# Altium project filtroFinal.PrjPCB
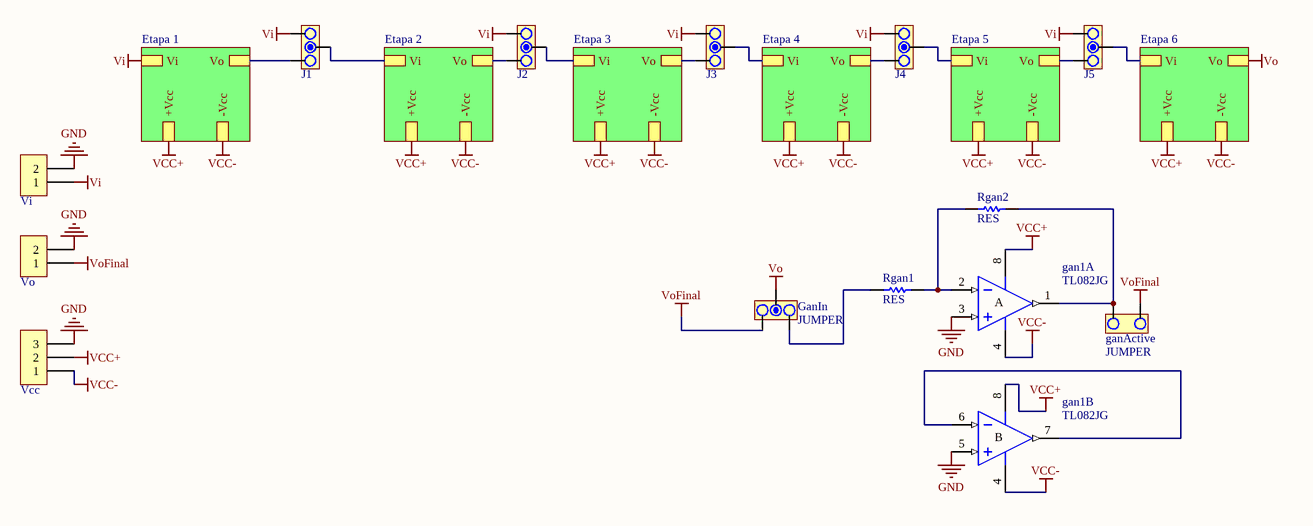
[diagram p0: filtroFinal-TC.SchDoc]
7 sheets, 131 parts. Net scope: hierarchical (ports join the sheet entries above them; power ports are global).
Sheets:
  filtroFinal-TC.SchDoc
    Etapa 1 = etapa1.SchDoc
    Etapa 2 = etapa2.SchDoc
    Etapa 3 = etapa3.SchDoc
    Etapa 4 = etapa4.SchDoc
    Etapa 5 = etapa5.SchDoc
    Etapa 6 = etapa6.SchDoc

## Sheet filtroFinal-TC.SchDoc
size Letter

### Parts
gan1  TL082JG  [JG008]  (parts A,B of 2)
ganActive  JUMPER  [JUMPER2]
GanIn  JUMPER  [JUMPER3]
J1  JUMPER  [JUMPER3]  (value not drawn)
J2  JUMPER  [JUMPER3]  (value not drawn)
J3  JUMPER  [JUMPER3]  (value not drawn)
J4  JUMPER  [JUMPER3]  (value not drawn)
J5  JUMPER  [JUMPER3]  (value not drawn)
Rgan1  RES  [RES300]
Rgan2  RES  [RES300]
Vcc  BORNERA 3  [BORNERA3]  (value not drawn)
Vi  BORNERA 2  [BORNERA2]  (value not drawn)
Vo  BORNERA 2  [BORNERA2]  (value not drawn)

### Sub-sheets
Etapa 1 = etapa1.SchDoc: -Vcc, +Vcc, Vi, Vo
Etapa 2 = etapa2.SchDoc: -Vcc, +Vcc, Vi, Vo
Etapa 3 = etapa3.SchDoc: -Vcc, +Vcc, Vi, Vo
Etapa 4 = etapa4.SchDoc: -Vcc, +Vcc, Vi, Vo
Etapa 5 = etapa5.SchDoc: -Vcc, +Vcc, Vi, Vo
Etapa 6 = etapa6.SchDoc: -Vcc, +Vcc, Vi, Vo

### Nets
GND: gan1.3(IN+) gan1.5(IN+) Vcc.3 Vi.2 Vo.2
VCC+: gan1.8(V+) Vcc.2 ; sheet Etapa 1/+Vcc, sheet Etapa 2/+Vcc, sheet Etapa 3/+Vcc, sheet Etapa 4/+Vcc, sheet Etapa 5/+Vcc, sheet Etapa 6/+Vcc  [project net -VCC]
VCC-: gan1.4(V-) Vcc.1 ; sheet Etapa 1/-Vcc, sheet Etapa 2/-Vcc, sheet Etapa 3/-Vcc, sheet Etapa 4/-Vcc, sheet Etapa 5/-Vcc, sheet Etapa 6/-Vcc  [project net +VCC]
Vi: J1.3 J2.3 J3.3 J4.3 J5.3 Vi.1 ; sheet Etapa 1/Vi
Vi(E2): J1.2 ; sheet Etapa 2/Vi
Vi(E3): J2.2 ; sheet Etapa 3/Vi
Vi(E4): J3.2 ; sheet Etapa 4/Vi
Vi(E5): J4.2 ; sheet Etapa 5/Vi
Vi(E6): J5.2 ; sheet Etapa 6/Vi
Vo: GanIn.2 ; sheet Etapa 6/Vo
Vo(E1): J1.1 ; sheet Etapa 1/Vo
Vo(E2): J2.1 ; sheet Etapa 2/Vo
Vo(E3): J3.1 ; sheet Etapa 3/Vo
Vo(E4): J4.1 ; sheet Etapa 4/Vo
Vo(E5): J5.1 ; sheet Etapa 5/Vo
VoFinal: ganActive.2 GanIn.3 Vo.1
Netgan1_1: gan1.1(OUT) ganActive.1 Rgan2.2
Netgan1_2: gan1.2(IN-) Rgan1.2 Rgan2.1
Netgan1_6: gan1.6(IN-) gan1.7(OUT)
NetGanIn_1: GanIn.1 Rgan1.1

### Notes on the sheet
- (in symbol TL082JG, part A) A
- (in symbol TL082JG, part B) B

### Library data of the parts
gan1 = TL082JG: JFET-Input Operational Amplifier; Published: 16-Jan-2001; LatestRevisionDate: 04-Mar-2005; LatestRevisionNote: Stylized 3D Model Added.; DatasheetVersion: Feb-1999; PackageVersion: Jan-1995; PackageReference: JG008; Publisher: Altium Limited; PackageDescription: DIP; 8 Leads; Row Spacing 7.62 mm; Pitch 2.54 mm; ComponentLink1Description: Manufacturer Link; ComponentLink1URL: http://www.ti.com/; ComponentLink2Description: Datasheet; ComponentLink2URL: http://www-s.ti.com/sc/ds/tl082.pdf
GanIn J1-J5 = JUMPER3

## Sheet etapa1.SchDoc
size A
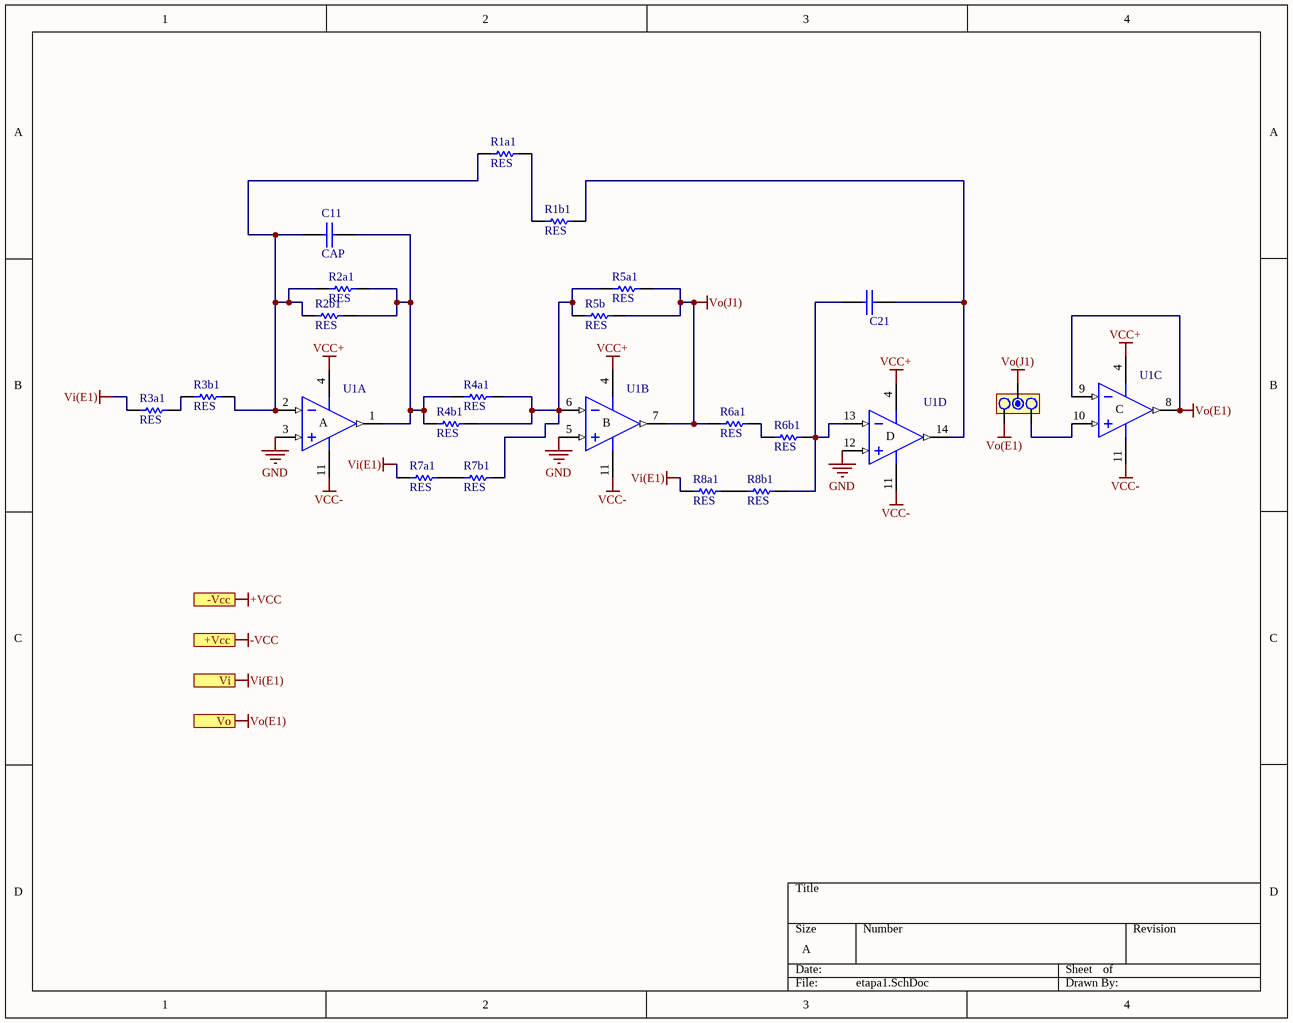
[diagram p1: etapa1.SchDoc]

### Parts
C11  CAP  [CAP200]
C21  CAP  [CAP200]  (value not drawn)
Jumper1  JUMPER  [JUMPER3]  (value not drawn)
R1a1  RES  [0805]
R1b1  RES  [0805]
R2a1  RES  [0805]
R2b1  RES  [0805]
R3a1  RES  [0805]
R3b1  RES  [0805]
R4a1  RES  [0805]
R4b1  RES  [0805]
R5a1  RES  [0805]
R5b  RES  [0805]
R6a1  RES  [0805]
R6b1  RES  [0805]
R7a1  RES  [0805]
R7b1  RES  [0805]
R8a1  RES  [0805]
R8b1  RES  [0805]
U1  TL084N  [N014]  (value not drawn)  (parts A,B,C,D of 4)

### Ports
+Vcc, -Vcc, Vi, Vo

### Nets
+VCC: U1.11(V-) ; port -Vcc  [also labelled VCC-]
-VCC: U1.4(V+) ; port +Vcc  [also labelled VCC+]
GND: U1.3(IN+) U1.5(IN+) U1.12(IN+)
Vi(E1): R3a1.1 R7a1.1 R8a1.1 ; port Vi  [project net Vi]
Vo(E1): Jumper1.3 U1.8(OUT) U1.9(IN-) ; port Vo
Vo(J1): Jumper1.2 R5a1.2 R5b.2 R6a1.1 U1.7(OUT)
NetC11_1: C11.1 R1a1.1 R2a1.1 R2b1.1 R3b1.2 U1.2(IN-)
NetC11_2: C11.2 R2a1.2 R2b1.2 R4a1.1 R4b1.1 U1.1(OUT)
NetC21_1: C21.1 R6b1.2 R8b1.2 U1.13(IN-)
NetC21_2: C21.2 R1b1.2 U1.14(OUT)
NetJumper1_1: Jumper1.1 U1.10(IN+)
NetR1a1_2: R1a1.2 R1b1.1
NetR3a1_2: R3a1.2 R3b1.1
NetR4a1_2: R4a1.2 R4b1.2 R5a1.1 R5b.1 R7b1.2 U1.6(IN-)
NetR6a1_2: R6a1.2 R6b1.1
NetR7a1_2: R7a1.2 R7b1.1
NetR8a1_2: R8a1.2 R8b1.1

### Notes on the sheet
- (in symbol TL084N, part A) A
- (in symbol TL084N, part B) B
- (in symbol TL084N, part C) C
- (in symbol TL084N, part D) D

### Library data of the parts
Jumper1 = JUMPER3
U1 = TL084N: JFET-Input Operational Amplifier; Published: 16-Jan-2001; LatestRevisionDate: 04-Mar-2005; LatestRevisionNote: Stylized 3D Model Added.; DatasheetVersion: Feb-1999; PackageVersion: Oct-1995; PackageReference: N014; Publisher: Altium Limited; PackageDescription: DIP; 14 Leads; Row Spacing 7.62 mm; Pitch 2.54 mm; ComponentLink1Description: Manufacturer Link; ComponentLink1URL: http://www.ti.com/; ComponentLink2Description: Datasheet; ComponentLink2URL: http://www-s.ti.com/sc/ds/tl084.pdf

## Sheet etapa2.SchDoc
size Letter
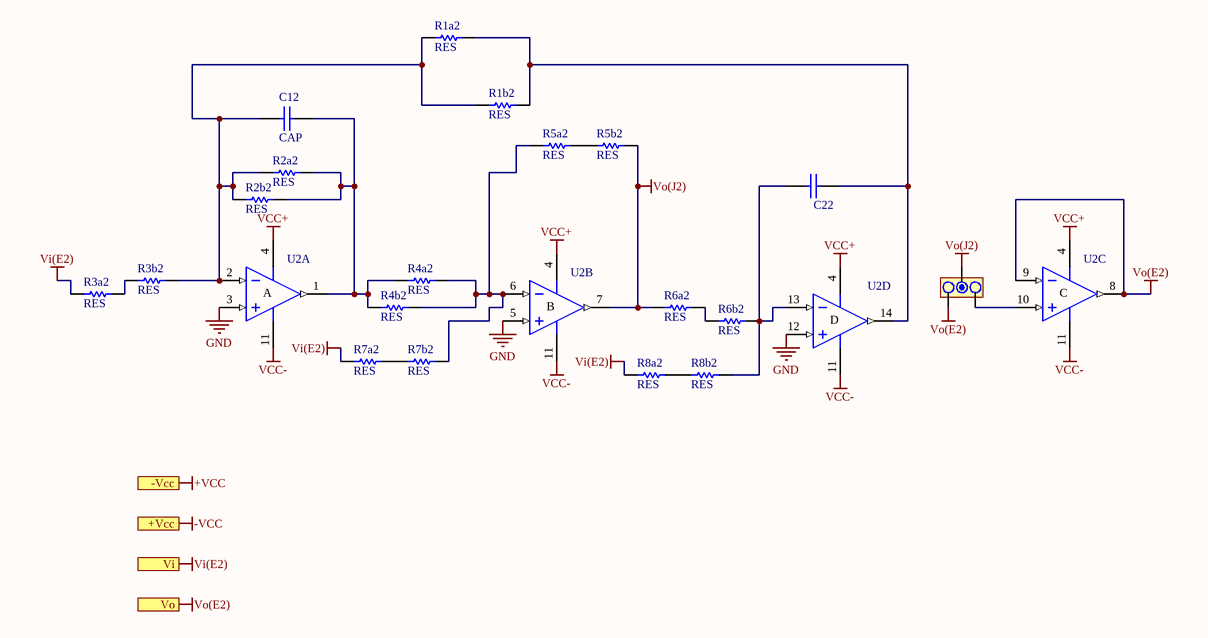
[diagram p2: etapa2.SchDoc]

### Parts
C12  CAP  [CAP200]
C22  CAP  [CAP200]  (value not drawn)
Jumper2  JUMPER  [JUMPER3]  (value not drawn)
R1a2  RES  [0805]
R1b2  RES  [0805]
R2a2  RES  [0805]
R2b2  RES  [0805]
R3a2  RES  [0805]
R3b2  RES  [0805]
R4a2  RES  [0805]
R4b2  RES  [0805]
R5a2  RES  [0805]
R5b2  RES  [0805]
R6a2  RES  [0805]
R6b2  RES  [0805]
R7a2  RES  [0805]
R7b2  RES  [0805]
R8a2  RES  [0805]
R8b2  RES  [0805]
U2  TL084N  [N014]  (value not drawn)  (parts A,B,C,D of 4)

### Ports
+Vcc, -Vcc, Vi, Vo

### Nets
+VCC: U2.11(V-) ; port -Vcc  [also labelled VCC-]
-VCC: U2.4(V+) ; port +Vcc  [also labelled VCC+]
GND: U2.3(IN+) U2.5(IN+) U2.12(IN+)
Vi(E2): R3a2.1 R7a2.1 R8a2.1 ; port Vi
Vo(E2): Jumper2.3 U2.8(OUT) U2.9(IN-) ; port Vo
Vo(J2): Jumper2.2 R5b2.2 R6a2.1 U2.7(OUT)
NetC12_1: C12.1 R1a2.1 R1b2.1 R2a2.1 R2b2.1 R3b2.2 U2.2(IN-)
NetC12_2: C12.2 R2a2.2 R2b2.2 R4a2.1 R4b2.1 U2.1(OUT)
NetC22_1: C22.1 R6b2.2 R8b2.2 U2.13(IN-)
NetC22_2: C22.2 R1a2.2 R1b2.2 U2.14(OUT)
NetJumper2_1: Jumper2.1 U2.10(IN+)
NetR3a2_2: R3a2.2 R3b2.1
NetR4a2_2: R4a2.2 R4b2.2 R5a2.1 R7b2.2 U2.6(IN-)
NetR5a2_2: R5a2.2 R5b2.1
NetR6a2_2: R6a2.2 R6b2.1
NetR7a2_2: R7a2.2 R7b2.1
NetR8a2_2: R8a2.2 R8b2.1

### Notes on the sheet
- (in symbol TL084N, part A) A
- (in symbol TL084N, part B) B
- (in symbol TL084N, part C) C
- (in symbol TL084N, part D) D

### Library data of the parts
Jumper2 = JUMPER3
U2 = TL084N: JFET-Input Operational Amplifier; Published: 16-Jan-2001; LatestRevisionDate: 04-Mar-2005; LatestRevisionNote: Stylized 3D Model Added.; DatasheetVersion: Feb-1999; PackageVersion: Oct-1995; PackageReference: N014; Publisher: Altium Limited; PackageDescription: DIP; 14 Leads; Row Spacing 7.62 mm; Pitch 2.54 mm; ComponentLink1Description: Manufacturer Link; ComponentLink1URL: http://www.ti.com/; ComponentLink2Description: Datasheet; ComponentLink2URL: http://www-s.ti.com/sc/ds/tl084.pdf

## Sheet etapa3.SchDoc
size Letter
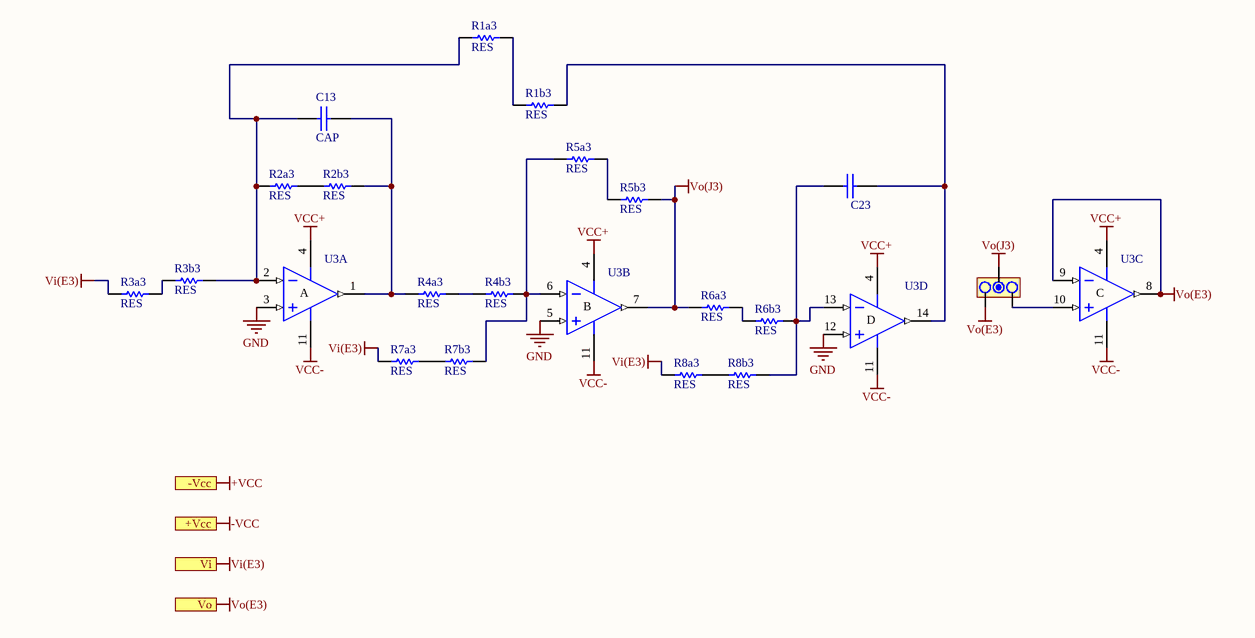
[diagram p3: etapa3.SchDoc]

### Parts
C13  CAP  [CAP200]
C23  CAP  [CAP200]  (value not drawn)
Jumper3  JUMPER  [JUMPER3]  (value not drawn)
R1a3  RES  [0805]
R1b3  RES  [0805]
R2a3  RES  [0805]
R2b3  RES  [0805]
R3a3  RES  [0805]
R3b3  RES  [0805]
R4a3  RES  [0805]
R4b3  RES  [0805]
R5a3  RES  [0805]
R5b3  RES  [0805]
R6a3  RES  [0805]
R6b3  RES  [0805]
R7a3  RES  [0805]
R7b3  RES  [0805]
R8a3  RES  [0805]
R8b3  RES  [0805]
U3  TL084N  [N014]  (value not drawn)  (parts A,B,C,D of 4)

### Ports
+Vcc, -Vcc, Vi, Vo

### Nets
+VCC: U3.11(V-) ; port -Vcc  [also labelled VCC-]
-VCC: U3.4(V+) ; port +Vcc  [also labelled VCC+]
GND: U3.3(IN+) U3.5(IN+) U3.12(IN+)
Vi(E3): R3a3.1 R7a3.1 R8a3.1 ; port Vi
Vo(E3): Jumper3.3 U3.8(OUT) U3.9(IN-) ; port Vo
Vo(J3): Jumper3.2 R5b3.2 R6a3.1 U3.7(OUT)
NetC13_1: C13.1 R1a3.1 R2a3.1 R3b3.2 U3.2(IN-)
NetC13_2: C13.2 R2b3.2 R4a3.1 U3.1(OUT)
NetC23_1: C23.1 R6b3.2 R8b3.2 U3.13(IN-)
NetC23_2: C23.2 R1b3.2 U3.14(OUT)
NetJumper3_1: Jumper3.1 U3.10(IN+)
NetR1a3_2: R1a3.2 R1b3.1
NetR2a3_2: R2a3.2 R2b3.1
NetR3a3_2: R3a3.2 R3b3.1
NetR4a3_2: R4a3.2 R4b3.1
NetR4b3_2: R4b3.2 R5a3.1 R7b3.2 U3.6(IN-)
NetR5a3_2: R5a3.2 R5b3.1
NetR6a3_2: R6a3.2 R6b3.1
NetR7a3_2: R7a3.2 R7b3.1
NetR8a3_2: R8a3.2 R8b3.1

### Notes on the sheet
- (in symbol TL084N, part A) A
- (in symbol TL084N, part B) B
- (in symbol TL084N, part C) C
- (in symbol TL084N, part D) D

### Library data of the parts
Jumper3 = JUMPER3
U3 = TL084N: JFET-Input Operational Amplifier; Published: 16-Jan-2001; LatestRevisionDate: 04-Mar-2005; LatestRevisionNote: Stylized 3D Model Added.; DatasheetVersion: Feb-1999; PackageVersion: Oct-1995; PackageReference: N014; Publisher: Altium Limited; PackageDescription: DIP; 14 Leads; Row Spacing 7.62 mm; Pitch 2.54 mm; ComponentLink1Description: Manufacturer Link; ComponentLink1URL: http://www.ti.com/; ComponentLink2Description: Datasheet; ComponentLink2URL: http://www-s.ti.com/sc/ds/tl084.pdf

## Sheet etapa4.SchDoc
size Letter
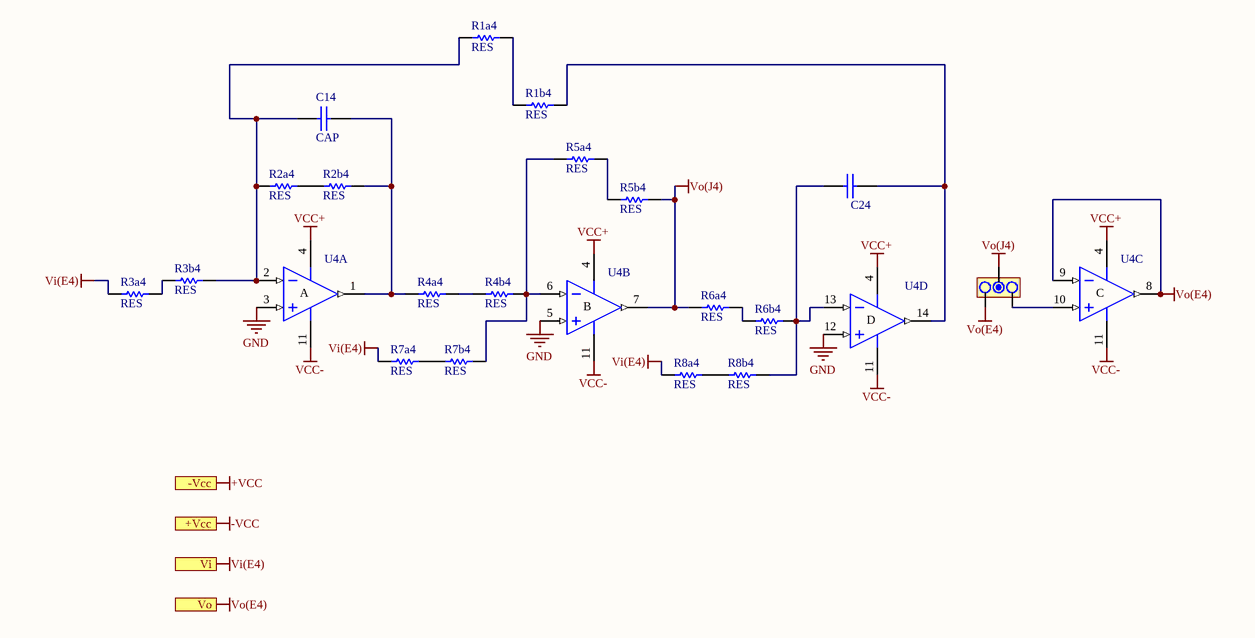
[diagram p4: etapa4.SchDoc]

### Parts
C14  CAP  [CAP200]
C24  CAP  [CAP200]  (value not drawn)
Jumper4  JUMPER  [JUMPER3]  (value not drawn)
R1a4  RES  [0805]
R1b4  RES  [0805]
R2a4  RES  [0805]
R2b4  RES  [0805]
R3a4  RES  [0805]
R3b4  RES  [0805]
R4a4  RES  [0805]
R4b4  RES  [0805]
R5a4  RES  [0805]
R5b4  RES  [0805]
R6a4  RES  [0805]
R6b4  RES  [0805]
R7a4  RES  [0805]
R7b4  RES  [0805]
R8a4  RES  [0805]
R8b4  RES  [0805]
U4  TL084N  [N014]  (value not drawn)  (parts A,B,C,D of 4)

### Ports
+Vcc, -Vcc, Vi, Vo

### Nets
+VCC: U4.11(V-) ; port -Vcc  [also labelled VCC-]
-VCC: U4.4(V+) ; port +Vcc  [also labelled VCC+]
GND: U4.3(IN+) U4.5(IN+) U4.12(IN+)
Vi(E4): R3a4.1 R7a4.1 R8a4.1 ; port Vi
Vo(E4): Jumper4.3 U4.8(OUT) U4.9(IN-) ; port Vo
Vo(J4): Jumper4.2 R5b4.2 R6a4.1 U4.7(OUT)
NetC14_1: C14.1 R1a4.1 R2a4.1 R3b4.2 U4.2(IN-)
NetC14_2: C14.2 R2b4.2 R4a4.1 U4.1(OUT)
NetC24_1: C24.1 R6b4.2 R8b4.2 U4.13(IN-)
NetC24_2: C24.2 R1b4.2 U4.14(OUT)
NetJumper4_1: Jumper4.1 U4.10(IN+)
NetR1a4_2: R1a4.2 R1b4.1
NetR2a4_2: R2a4.2 R2b4.1
NetR3a4_2: R3a4.2 R3b4.1
NetR4a4_2: R4a4.2 R4b4.1
NetR4b4_2: R4b4.2 R5a4.1 R7b4.2 U4.6(IN-)
NetR5a4_2: R5a4.2 R5b4.1
NetR6a4_2: R6a4.2 R6b4.1
NetR7a4_2: R7a4.2 R7b4.1
NetR8a4_2: R8a4.2 R8b4.1

### Notes on the sheet
- (in symbol TL084N, part A) A
- (in symbol TL084N, part B) B
- (in symbol TL084N, part C) C
- (in symbol TL084N, part D) D

### Library data of the parts
Jumper4 = JUMPER3
U4 = TL084N: JFET-Input Operational Amplifier; Published: 16-Jan-2001; LatestRevisionDate: 04-Mar-2005; LatestRevisionNote: Stylized 3D Model Added.; DatasheetVersion: Feb-1999; PackageVersion: Oct-1995; PackageReference: N014; Publisher: Altium Limited; PackageDescription: DIP; 14 Leads; Row Spacing 7.62 mm; Pitch 2.54 mm; ComponentLink1Description: Manufacturer Link; ComponentLink1URL: http://www.ti.com/; ComponentLink2Description: Datasheet; ComponentLink2URL: http://www-s.ti.com/sc/ds/tl084.pdf

## Sheet etapa5.SchDoc
size Letter
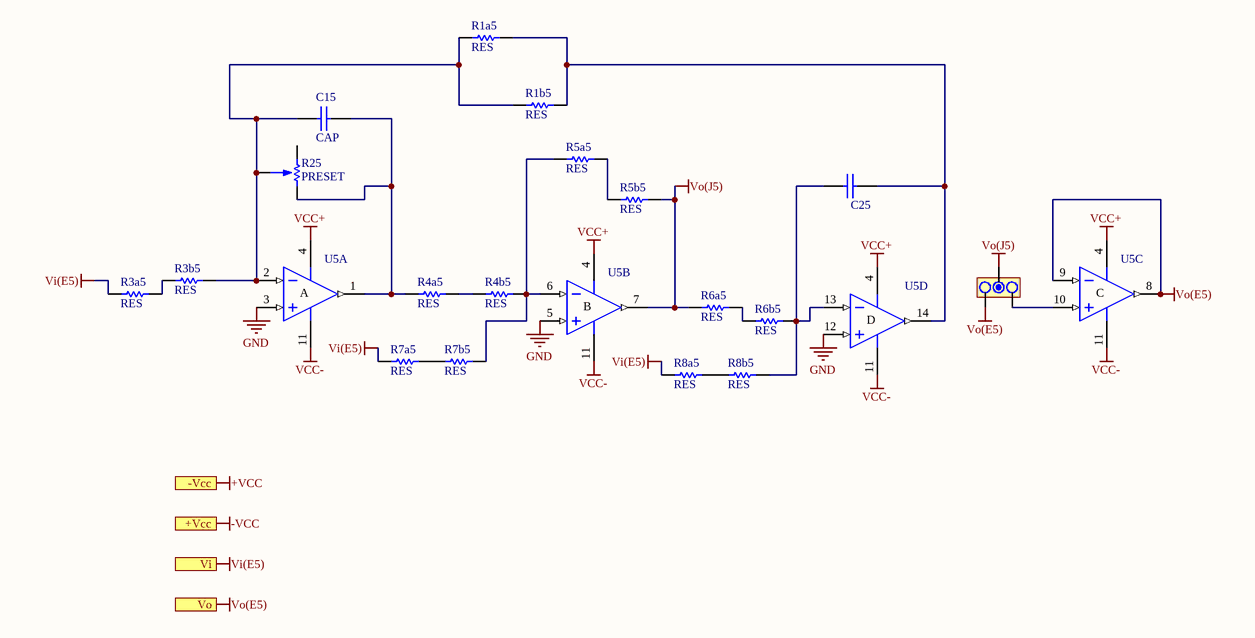
[diagram p5: etapa5.SchDoc]

### Parts
C15  CAP  [CAP200]
C25  CAP  [CAP200]  (value not drawn)
Jumper5  JUMPER  [JUMPER3]  (value not drawn)
R1a5  RES  [0805]
R1b5  RES  [0805]
R3a5  RES  [0805]
R3b5  RES  [0805]
R4a5  RES  [0805]
R4b5  RES  [0805]
R5a5  RES  [0805]
R5b5  RES  [0805]
R6a5  RES  [0805]
R6b5  RES  [0805]
R7a5  RES  [0805]
R7b5  RES  [0805]
R8a5  RES  [0805]
R8b5  RES  [0805]
R25  PRESET  [PRESET V]
U5  TL084N  [N014]  (value not drawn)  (parts A,B,C,D of 4)

### Ports
+Vcc, -Vcc, Vi, Vo

### Nets
+VCC: U5.11(V-) ; port -Vcc  [also labelled VCC-]
-VCC: U5.4(V+) ; port +Vcc  [also labelled VCC+]
GND: U5.3(IN+) U5.5(IN+) U5.12(IN+)
Vi(E5): R3a5.1 R7a5.1 R8a5.1 ; port Vi
Vo(E5): Jumper5.3 U5.8(OUT) U5.9(IN-) ; port Vo
Vo(J5): Jumper5.2 R5b5.2 R6a5.1 U5.7(OUT)
NetC15_1: C15.1 R1a5.1 R1b5.1 R3b5.2 R25.2 U5.2(IN-)
NetC15_2: C15.2 R4a5.1 R25.1 U5.1(OUT)
NetC25_1: C25.1 R6b5.2 R8b5.2 U5.13(IN-)
NetC25_2: C25.2 R1a5.2 R1b5.2 U5.14(OUT)
NetJumper5_1: Jumper5.1 U5.10(IN+)
NetR3a5_2: R3a5.2 R3b5.1
NetR4a5_2: R4a5.2 R4b5.1
NetR4b5_2: R4b5.2 R5a5.1 R7b5.2 U5.6(IN-)
NetR5a5_2: R5a5.2 R5b5.1
NetR6a5_2: R6a5.2 R6b5.1
NetR7a5_2: R7a5.2 R7b5.1
NetR8a5_2: R8a5.2 R8b5.1

Not connected (* = marked no-connect by the designer): R25 3

### Notes on the sheet
- (in symbol TL084N, part A) A
- (in symbol TL084N, part B) B
- (in symbol TL084N, part C) C
- (in symbol TL084N, part D) D

### Library data of the parts
Jumper5 = JUMPER3
U5 = TL084N: JFET-Input Operational Amplifier; Published: 16-Jan-2001; LatestRevisionDate: 04-Mar-2005; LatestRevisionNote: Stylized 3D Model Added.; DatasheetVersion: Feb-1999; PackageVersion: Oct-1995; PackageReference: N014; Publisher: Altium Limited; PackageDescription: DIP; 14 Leads; Row Spacing 7.62 mm; Pitch 2.54 mm; ComponentLink1Description: Manufacturer Link; ComponentLink1URL: http://www.ti.com/; ComponentLink2Description: Datasheet; ComponentLink2URL: http://www-s.ti.com/sc/ds/tl084.pdf

## Sheet etapa6.SchDoc
size Letter
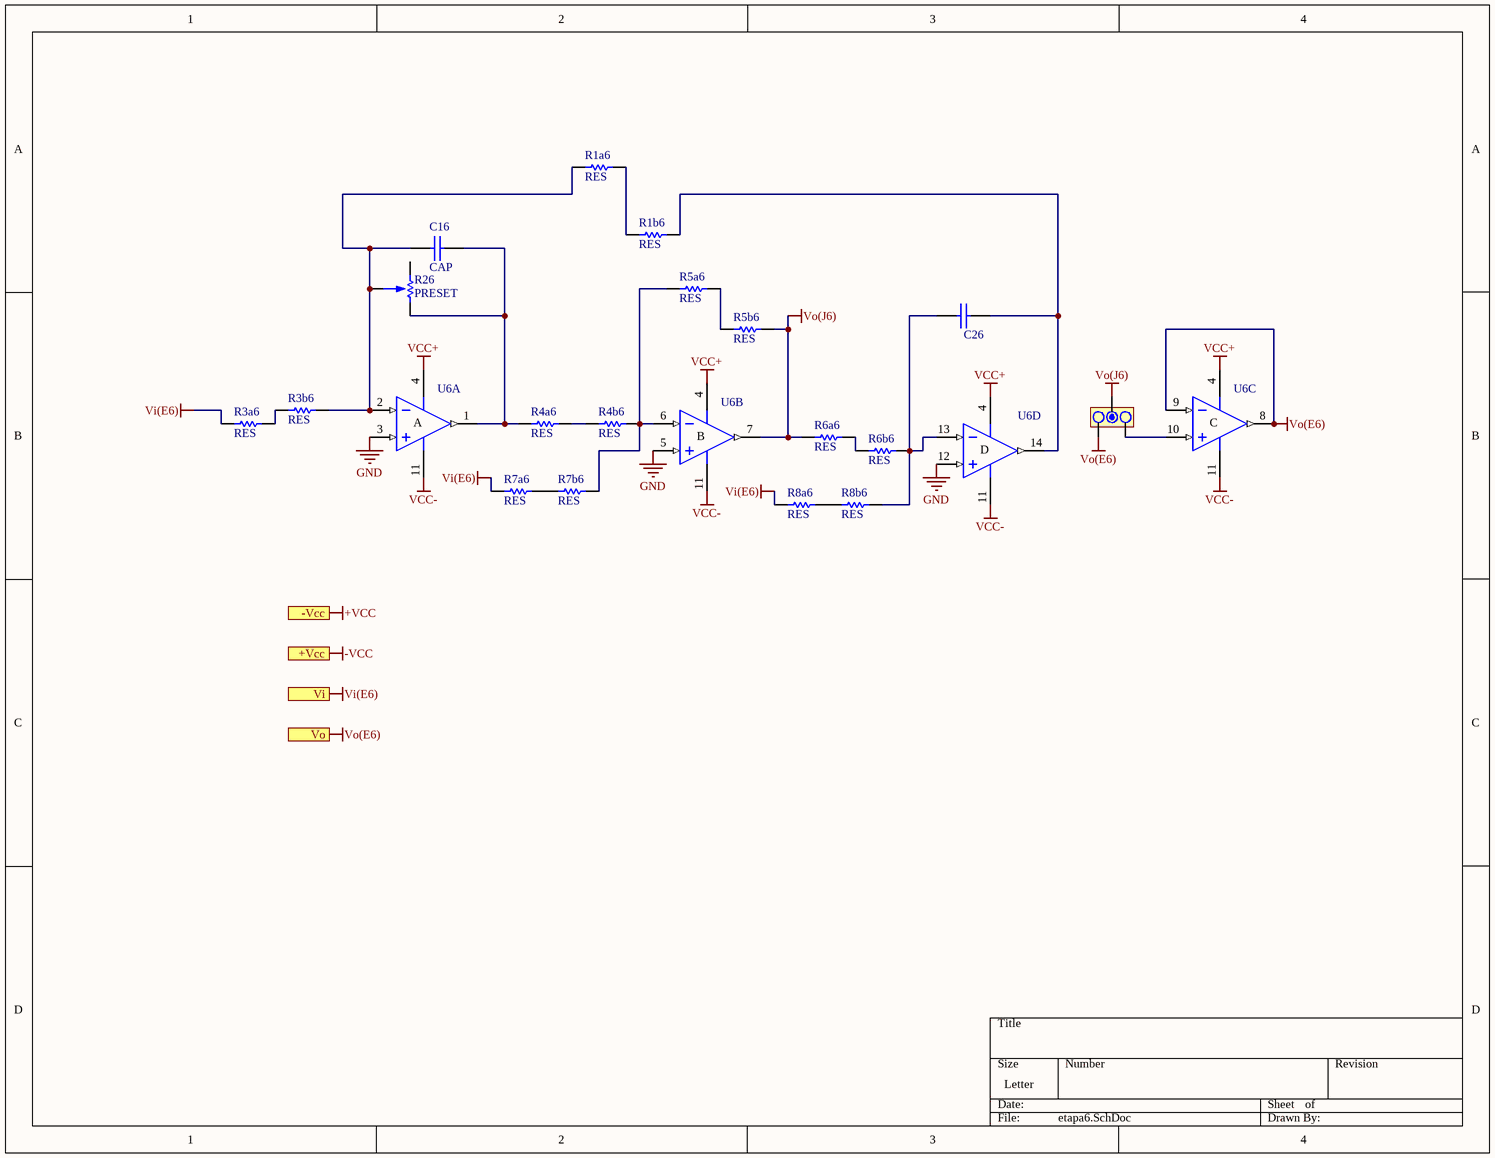
[diagram p6: etapa6.SchDoc]

### Parts
C16  CAP  [CAP200]
C26  CAP  [CAP200]  (value not drawn)
Jumper6  JUMPER  [JUMPER3]  (value not drawn)
R1a6  RES  [0805]
R1b6  RES  [0805]
R3a6  RES  [0805]
R3b6  RES  [0805]
R4a6  RES  [0805]
R4b6  RES  [0805]
R5a6  RES  [0805]
R5b6  RES  [0805]
R6a6  RES  [0805]
R6b6  RES  [0805]
R7a6  RES  [0805]
R7b6  RES  [0805]
R8a6  RES  [0805]
R8b6  RES  [0805]
R26  PRESET  [PRESET V]
U6  TL084N  [N014]  (value not drawn)  (parts A,B,C,D of 4)

### Ports
+Vcc, -Vcc, Vi, Vo

### Nets
+VCC: U6.11(V-) ; port -Vcc  [also labelled VCC-]
-VCC: U6.4(V+) ; port +Vcc  [also labelled VCC+]
GND: U6.3(IN+) U6.5(IN+) U6.12(IN+)
Vi(E6): R3a6.1 R7a6.1 R8a6.1 ; port Vi
Vo(E6): Jumper6.3 U6.8(OUT) U6.9(IN-) ; port Vo  [project net Vo]
Vo(J6): Jumper6.2 R5b6.2 R6a6.1 U6.7(OUT)
NetC16_1: C16.1 R1a6.1 R3b6.2 R26.2 U6.2(IN-)
NetC16_2: C16.2 R4a6.1 R26.1 U6.1(OUT)
NetC26_1: C26.1 R6b6.2 R8b6.2 U6.13(IN-)
NetC26_2: C26.2 R1b6.2 U6.14(OUT)
NetJumper6_1: Jumper6.1 U6.10(IN+)
NetR1a6_2: R1a6.2 R1b6.1
NetR3a6_2: R3a6.2 R3b6.1
NetR4a6_2: R4a6.2 R4b6.1
NetR4b6_2: R4b6.2 R5a6.1 R7b6.2 U6.6(IN-)
NetR5a6_2: R5a6.2 R5b6.1
NetR6a6_2: R6a6.2 R6b6.1
NetR7a6_2: R7a6.2 R7b6.1
NetR8a6_2: R8a6.2 R8b6.1

Not connected (* = marked no-connect by the designer): R26 3

### Notes on the sheet
- (in symbol TL084N, part A) A
- (in symbol TL084N, part B) B
- (in symbol TL084N, part C) C
- (in symbol TL084N, part D) D

### Library data of the parts
Jumper6 = JUMPER3
U6 = TL084N: JFET-Input Operational Amplifier; Published: 16-Jan-2001; LatestRevisionDate: 04-Mar-2005; LatestRevisionNote: Stylized 3D Model Added.; DatasheetVersion: Feb-1999; PackageVersion: Oct-1995; PackageReference: N014; Publisher: Altium Limited; PackageDescription: DIP; 14 Leads; Row Spacing 7.62 mm; Pitch 2.54 mm; ComponentLink1Description: Manufacturer Link; ComponentLink1URL: http://www.ti.com/; ComponentLink2Description: Datasheet; ComponentLink2URL: http://www-s.ti.com/sc/ds/tl084.pdf

## Nets that join several sheets
+VCC: filtroFinal-TC (gan1.4 Vcc.1), etapa1 (U1.11), etapa2 (U2.11), etapa3 (U3.11), etapa4 (U4.11), etapa5 (U5.11), etapa6 (U6.11)
-VCC: filtroFinal-TC (gan1.8 Vcc.2), etapa1 (U1.4), etapa2 (U2.4), etapa3 (U3.4), etapa4 (U4.4), etapa5 (U5.4), etapa6 (U6.4)
GND: filtroFinal-TC (5 pins), etapa1 (U1.3 U1.5 U1.12), etapa2 (U2.3 U2.5 U2.12), etapa3 (U3.3 U3.5 U3.12), etapa4 (U4.3 U4.5 U4.12), etapa5 (U5.3 U5.5 U5.12), etapa6 (U6.3 U6.5 U6.12)
Vi: filtroFinal-TC (6 pins), etapa1 (R3a1.1 R7a1.1 R8a1.1)
Vi(E2): filtroFinal-TC (J1.2), etapa2 (R3a2.1 R7a2.1 R8a2.1)
Vi(E3): filtroFinal-TC (J2.2), etapa3 (R3a3.1 R7a3.1 R8a3.1)
Vi(E4): filtroFinal-TC (J3.2), etapa4 (R3a4.1 R7a4.1 R8a4.1)
Vi(E5): filtroFinal-TC (J4.2), etapa5 (R3a5.1 R7a5.1 R8a5.1)
Vi(E6): filtroFinal-TC (J5.2), etapa6 (R3a6.1 R7a6.1 R8a6.1)
Vo: filtroFinal-TC (GanIn.2), etapa6 (Jumper6.3 U6.8 U6.9)
Vo(E1): filtroFinal-TC (J1.1), etapa1 (Jumper1.3 U1.8 U1.9)
Vo(E2): filtroFinal-TC (J2.1), etapa2 (Jumper2.3 U2.8 U2.9)
Vo(E3): filtroFinal-TC (J3.1), etapa3 (Jumper3.3 U3.8 U3.9)
Vo(E4): filtroFinal-TC (J4.1), etapa4 (Jumper4.3 U4.8 U4.9)
Vo(E5): filtroFinal-TC (J5.1), etapa5 (Jumper5.3 U5.8 U5.9)